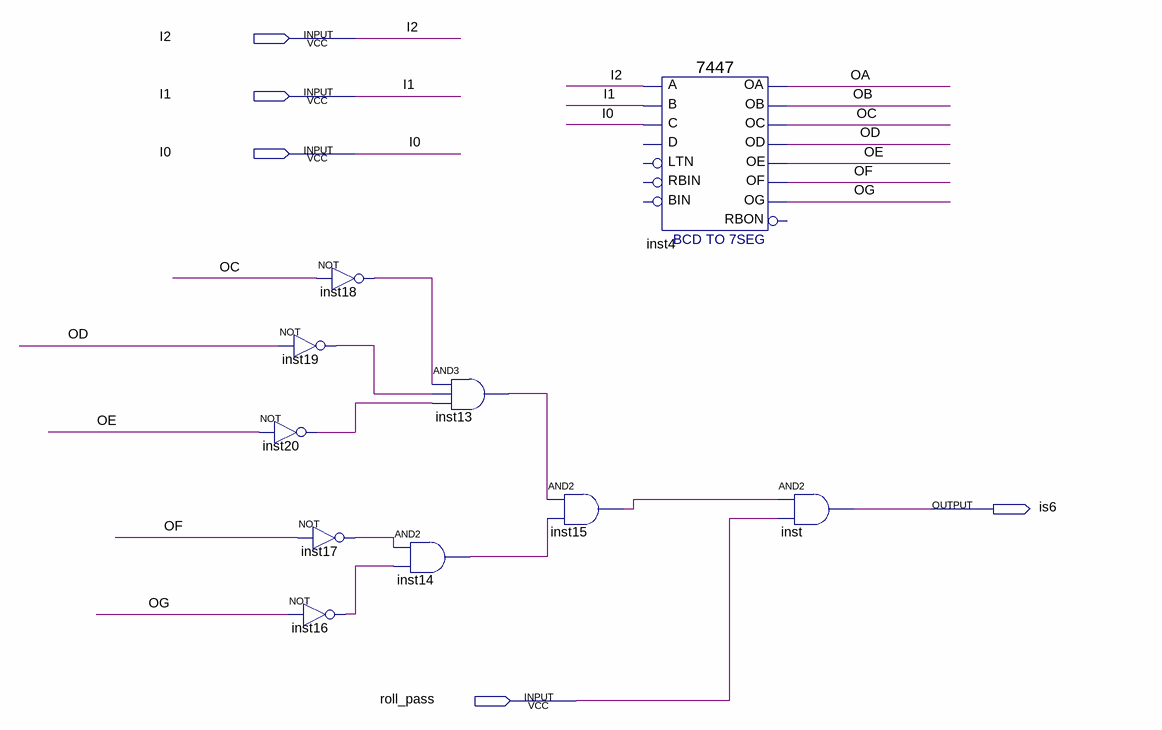
[diagram p0: schematic sheet]
// Quartus schematic is_a_6.bdf as structural Verilog: 10 symbols, 5 pins
module is_a_6 (
  input  I2,
  input  I1,
  input  I0,
  input  roll_pass,
  output is6
);

  wire inst13_out, inst14_out, inst15_out, inst16_out, inst17_out, inst18_out, inst19_out, inst20_out, OA,
       OB, OC, OD, OE, OF, OG;

  not inst19 (inst19_out, OD);
  not inst20 (inst20_out, OE);
  not inst18 (inst18_out, OC);
  not inst17 (inst17_out, OF);
  not inst16 (inst16_out, OG);
  and inst13 (inst13_out, inst18_out, inst19_out, inst20_out);
  and inst14 (inst14_out, inst17_out, inst16_out);
  and inst15 (inst15_out, inst13_out, inst14_out);
  \7447  inst4 (
    .B(I1), .C(I0), .A(I2), .OB(OB), .OC(OC), .OE(OE), .OD(OD), .OF(OF), .OG(OG), .OA(OA));  // open: LTN, D, RBIN, BIN, RBON
  and inst (is6, inst15_out, roll_pass);
endmodule
